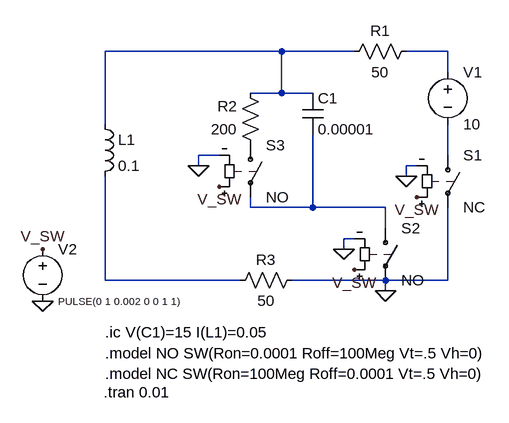
[diagram p0: schematic ltspice.asc]
ltspice.asc, the LTspice schematic file:
Version 4
SHEET 1 916 680
WIRE 160 32 -112 32
WIRE 272 32 160 32
WIRE 416 32 352 32
WIRE 416 64 416 32
WIRE 160 96 160 32
WIRE 160 96 112 96
WIRE 208 96 160 96
WIRE -112 144 -112 32
WIRE 64 192 32 192
WIRE 416 192 416 144
WIRE 32 208 32 192
WIRE 368 208 352 208
WIRE 352 224 352 208
WIRE 112 272 112 256
WIRE 208 272 208 160
WIRE 208 272 112 272
WIRE 320 272 208 272
WIRE 320 304 320 272
WIRE 272 320 256 320
WIRE 256 336 256 320
WIRE -112 384 -112 224
WIRE 96 384 -112 384
WIRE 320 384 176 384
WIRE 416 384 416 272
WIRE 416 384 320 384
WIRE 320 400 320 384
FLAG 32 208 0
FLAG 256 336 0
FLAG -208 416 0
FLAG 352 224 0
FLAG 320 400 0
FLAG 368 256 V_SW
FLAG 272 368 V_SW
FLAG 64 240 V_SW
FLAG -208 336 V_SW
SYMBOL res 368 16 R90
WINDOW 0 0 56 VBottom 2
WINDOW 3 32 56 VTop 2
SYMATTR InstName R1
SYMATTR Value 50
SYMBOL res 128 192 R180
WINDOW 0 36 76 Left 2
WINDOW 3 36 40 Left 2
SYMATTR InstName R2
SYMATTR Value 200
SYMBOL cap 192 96 R0
SYMATTR InstName C1
SYMATTR Value 0.00001
SYMBOL ind -128 128 R0
SYMATTR InstName L1
SYMATTR Value 0.1
SYMBOL res 192 368 R90
WINDOW 0 0 56 VBottom 2
WINDOW 3 32 56 VTop 2
SYMATTR InstName R3
SYMATTR Value 50
SYMBOL sw 112 160 R0
SYMATTR InstName S3
SYMATTR Value NO
SYMBOL voltage -208 320 R0
WINDOW 3 24 96 Left 1
WINDOW 123 0 0 Left 0
WINDOW 39 0 0 Left 0
SYMATTR InstName V2
SYMATTR Value PULSE(0 1 0.002 0 0 1 1)
SYMBOL sw 320 288 R0
SYMATTR InstName S2
SYMATTR Value NO
SYMBOL sw 416 176 R0
SYMATTR InstName S1
SYMATTR Value NC
SYMBOL voltage 416 48 R0
WINDOW 123 0 0 Left 0
WINDOW 39 0 0 Left 0
SYMATTR InstName V1
SYMATTR Value 10
TEXT -112 496 Left 2 !.model NO SW(Ron=0.0001 Roff=100Meg Vt=.5 Vh=0)
TEXT -112 528 Left 2 !.model NC SW(Ron=100Meg Roff=0.0001 Vt=.5 Vh=0)
TEXT -114 556 Left 2 !.tran 0.01
TEXT -112 464 Left 2 !.ic V(C1)=15 I(L1)=0.05

The netlist it stands for:
* ltspice.asc
R1 N002 N001 50
R2 P001 N001 200
C1 N001 N004 0.00001
L1 N001 N005 0.1
R3 0 N005 50
S3 P001 N004 V_SW 0 NO
V2 V_SW 0 PULSE(0 1 0.002 0 0 1 1)
S2 N004 0 V_SW 0 NO
S1 N003 0 V_SW 0 NC
V1 N002 N003 10
.model NO SW(Ron=0.0001 Roff=100Meg Vt=.5 Vh=0)
.model NC SW(Ron=100Meg Roff=0.0001 Vt=.5 Vh=0)
.tran 0.01
.ic V(C1)=15 I(L1)=0.05
.backanno
.end